# Altium project FIT_TCM.PrjPcb (part 7 of 9)

## Sheet FIT_HDMI_X19-9.SchDoc: FIT_PM12 board
size 420 x 297 mm; CheckedBy: G.Kasprowicz; Author: INR Moscow; CompanyName: WUT ISE; DrawnBy: M.Podgórski; Organization: WUT ISE; Address1: PW ISE; Address2: Nowowiejska 15/19 00-665 Warsaw; Address3: gkasprow@gmail.com; Revision: 2; SheetNumber: -; SheetTotal: -; ModifiedBy: -; CheckedDate: -; Title2: Title 2; DivGrp: WUT ISE; Designer: INR RAS; ModifiedDate: -; ProjectName: Sensor Box
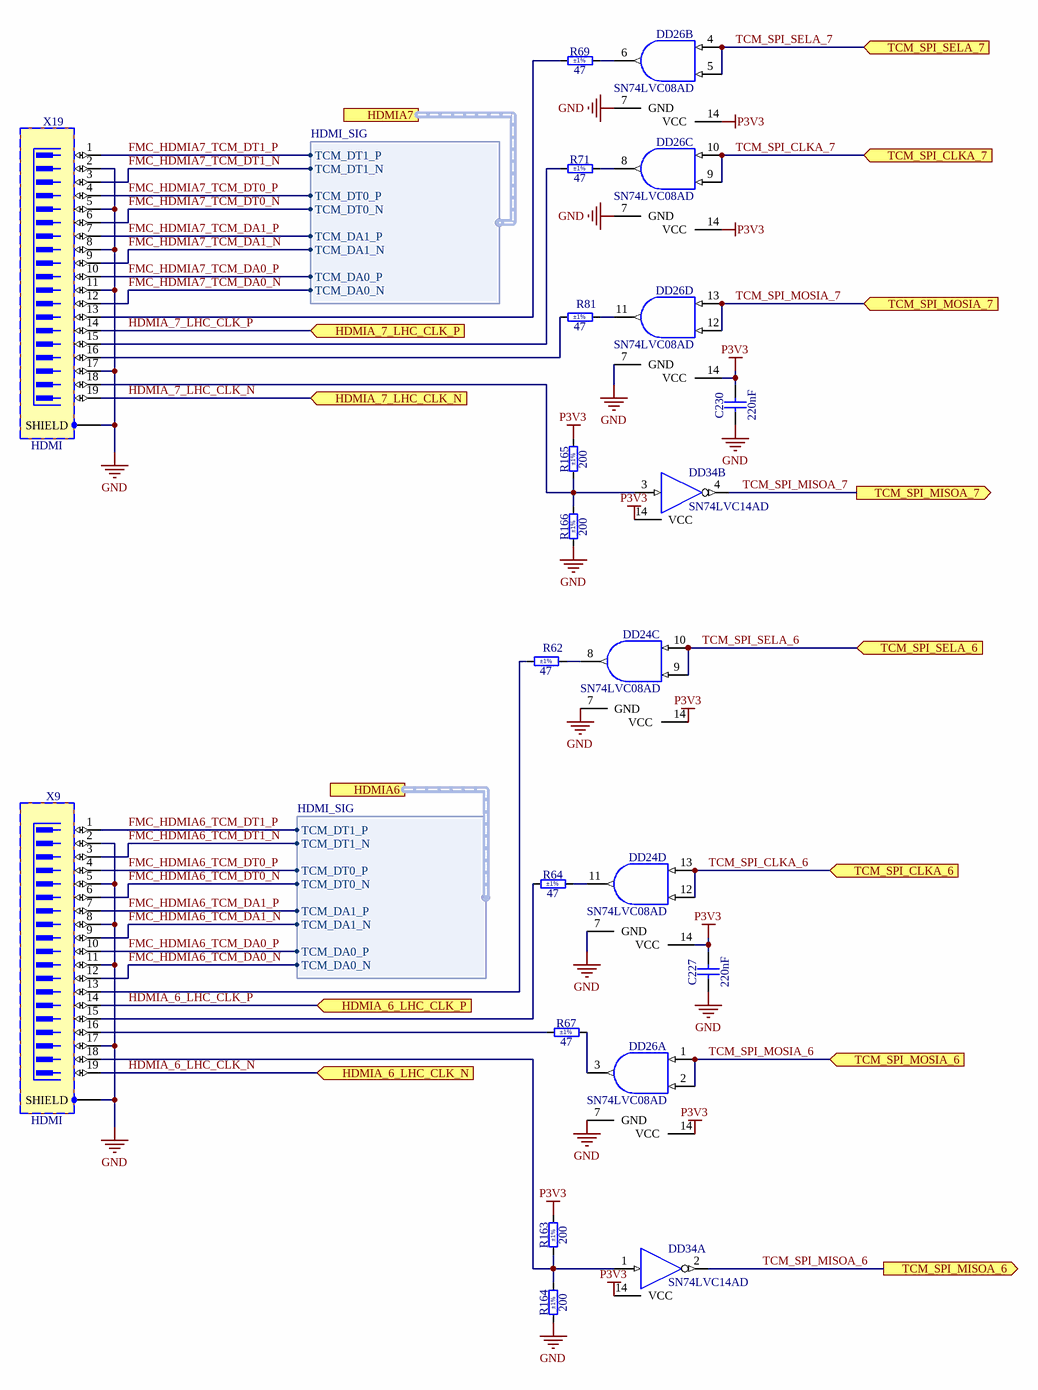
[diagram p22: FIT_HDMI_X19-9.SchDoc]

### Parts
C227  220nF  [CAPC2012X135N]
C230  220nF  [CAPC2012X135N]
DD24  SN74LVC08AD  [SOIC127P600X175-14N]  (parts C,D of 4)
DD26  SN74LVC08AD  [SOIC127P600X175-14N]  (parts A,B,C,D of 4)
DD34  SN74LVC14AD  [SOIC127P600X175-14N]  (parts A,B of 6)
R62  47  Tolerance: ±1%  [RESC2012X60N]
R64  47  Tolerance: ±1%  [RESC2012X60N]
R67  47  Tolerance: ±1%  [RESC2012X60N]
R69  47  Tolerance: ±1%  [RESC2012X60N]
R71  47  Tolerance: ±1%  [RESC2012X60N]
R81  47  Tolerance: ±1%  [RESC2012X60N]
R163  200  Tolerance: ±1%  [RESC2012X60N]
R164  200  Tolerance: ±1%  [RESC2012X60N]
R165  200  Tolerance: ±1%  [RESC2012X60N]
R166  200  Tolerance: ±1%  [RESC2012X60N]
X9  HDMI  [TYCO_2007435-1]
X19  HDMI  [TYCO_2007435-1]

### Ports
HDMIA6 (harness HDMI_SIG), HDMIA7 (harness HDMI_SIG), HDMIA_6_LHC_CLK_N (in), HDMIA_6_LHC_CLK_P (in), HDMIA_7_LHC_CLK_N (in), HDMIA_7_LHC_CLK_P (in), TCM_SPI_CLKA_6 (in), TCM_SPI_CLKA_7 (in), TCM_SPI_MISOA_6 (out), TCM_SPI_MISOA_7 (out), TCM_SPI_MOSIA_6 (in), TCM_SPI_MOSIA_7 (in), TCM_SPI_SELA_6 (in), TCM_SPI_SELA_7 (in)

### Harnesses
HDMI_SIG: TCM_DT1_P, TCM_DT1_N, TCM_DT0_P, TCM_DT0_N, TCM_DA1_P, TCM_DA1_N, TCM_DA0_P, TCM_DA0_N

### Nets
GND: C227.1 C230.1 DD24.7(GND) DD26.7(GND) DD34.7(GND) R164.1 R166.1 X9.2 X9.5 X9.8 X9.11 X9.17 X9.SHIELD X19.2 X19.5 X19.8 X19.11 X19.17 X19.SHIELD
P3V3: C227.2 C230.2 DD24.14(VCC) DD26.14(VCC) DD34.14(VCC) R163.2 R165.2  [also labelled VCC]
FMC_HDMIA6_TCM_DA0_N: X9.12 ; port HDMIA6.TCM_DA0_N  [project net HDMIA6.TCM_DA0_N]
FMC_HDMIA6_TCM_DA0_P: X9.10 ; port HDMIA6.TCM_DA0_P  [project net HDMIA6.TCM_DA0_P]
FMC_HDMIA6_TCM_DA1_N: X9.9 ; port HDMIA6.TCM_DA1_N  [project net HDMIA6.TCM_DA1_N]
FMC_HDMIA6_TCM_DA1_P: X9.7 ; port HDMIA6.TCM_DA1_P  [project net HDMIA6.TCM_DA1_P]
FMC_HDMIA6_TCM_DT0_N: X9.6 ; port HDMIA6.TCM_DT0_N  [project net HDMIA6.TCM_DT0_N]
FMC_HDMIA6_TCM_DT0_P: X9.4 ; port HDMIA6.TCM_DT0_P  [project net HDMIA6.TCM_DT0_P]
FMC_HDMIA6_TCM_DT1_N: X9.3 ; port HDMIA6.TCM_DT1_N  [project net HDMIA6.TCM_DT1_N]
FMC_HDMIA6_TCM_DT1_P: X9.1 ; port HDMIA6.TCM_DT1_P  [project net HDMIA6.TCM_DT1_P]
FMC_HDMIA7_TCM_DA0_N: X19.12 ; port HDMIA7.TCM_DA0_N  [project net HDMIA7.TCM_DA0_N]
FMC_HDMIA7_TCM_DA0_P: X19.10 ; port HDMIA7.TCM_DA0_P  [project net HDMIA7.TCM_DA0_P]
FMC_HDMIA7_TCM_DA1_N: X19.9 ; port HDMIA7.TCM_DA1_N  [project net HDMIA7.TCM_DA1_N]
FMC_HDMIA7_TCM_DA1_P: X19.7 ; port HDMIA7.TCM_DA1_P  [project net HDMIA7.TCM_DA1_P]
FMC_HDMIA7_TCM_DT0_N: X19.6 ; port HDMIA7.TCM_DT0_N  [project net HDMIA7.TCM_DT0_N]
FMC_HDMIA7_TCM_DT0_P: X19.4 ; port HDMIA7.TCM_DT0_P  [project net HDMIA7.TCM_DT0_P]
FMC_HDMIA7_TCM_DT1_N: X19.3 ; port HDMIA7.TCM_DT1_N  [project net HDMIA7.TCM_DT1_N]
FMC_HDMIA7_TCM_DT1_P: X19.1 ; port HDMIA7.TCM_DT1_P  [project net HDMIA7.TCM_DT1_P]
HDMIA_6_LHC_CLK_N: X9.19 ; port HDMIA_6_LHC_CLK_N  [project net HDMIA_LHC.6_LHC_CLK_N]
HDMIA_6_LHC_CLK_P: X9.14 ; port HDMIA_6_LHC_CLK_P  [project net HDMIA_LHC.6_LHC_CLK_P]
HDMIA_7_LHC_CLK_N: X19.19 ; port HDMIA_7_LHC_CLK_N  [project net HDMIA_LHC.7_LHC_CLK_N]
HDMIA_7_LHC_CLK_P: X19.14 ; port HDMIA_7_LHC_CLK_P  [project net HDMIA_LHC.7_LHC_CLK_P]
TCM_SPI_CLKA_6: DD24.12(B) DD24.13(A) ; port TCM_SPI_CLKA_6
TCM_SPI_CLKA_7: DD26.9(B) DD26.10(A) ; port TCM_SPI_CLKA_7
TCM_SPI_MISOA_6: DD34.2(OUT) ; port TCM_SPI_MISOA_6
TCM_SPI_MISOA_7: DD34.4(OUT) ; port TCM_SPI_MISOA_7
TCM_SPI_MOSIA_6: DD26.1(A) DD26.2(B) ; port TCM_SPI_MOSIA_6
TCM_SPI_MOSIA_7: DD26.12(B) DD26.13(A) ; port TCM_SPI_MOSIA_7
TCM_SPI_SELA_6: DD24.9(B) DD24.10(A) ; port TCM_SPI_SELA_6
TCM_SPI_SELA_7: DD26.4(A) DD26.5(B) ; port TCM_SPI_SELA_7
NetDD24_8: DD24.8(Y) R62.2
NetDD24_11: DD24.11(Y) R64.2
NetDD26_3: DD26.3(Y) R67.2
NetDD26_6: DD26.6(Y) R69.2
NetDD26_8: DD26.8(Y) R71.2
NetDD26_11: DD26.11(Y) R81.2
NetDD34_1: DD34.1(IN) R163.1 R164.2 X9.18
NetDD34_3: DD34.3(IN) R165.1 R166.2 X19.18
NetR62_1: R62.1 X9.13
NetR64_1: R64.1 X9.15
NetR67_1: R67.1 X9.16
NetR69_1: R69.1 X19.13
NetR71_1: R71.1 X19.15
NetR81_1: R81.1 X19.16

### Notes on the sheet
- Project/Equipment
- Document
- Designer
- Drawn by
- Check.by
- Copyright WUT ISE 2024.
  This documentation describes Open Hardware and is licensed under the CERN OHL v.2. You may redistribute and modify this documentation under the terms of the CERN OHL v.2. (http://ohwr.org/CERNOHL). This documentation is distributed WITHOUT ANY EXPRESS OR IMPLIED WARRANTY, INCLUDING OF MERCHANTABILITY, SATISFACTORY QUALITY AND FITNESS FOR A PARTICULAR PURPOSE. Please see the CERN OHL v.2 for applicable conditions.
- Contact
- File
- Last Mod.
- Print Date
- Sheet
- Size
- A3
- of
- Rev

### Library data of the parts
C227 C230 = CC0805_220NF_50V_10%_X7R: Non-polarised capacitor; Part Description: SMD Multilayer Chip Ceramic Capacitor; Manufacturer: GENERIC; Manufacturer1 Part Number: GRM21BR71H224KA01L; Voltage: 50V; TC: X7R; Tolerance: ±10%; Part Number: CC0805_220NF_50V_10%_X7R; Component Kind: Standard; Component Type: Standard; Pin Count: 2; Value: 220nF; Status: Preferred; Manufacturer Part Number: CC0805_220NF_50V_10%_X7R; Case: 0805; Mounted: Yes; Socket: No; SMD: Yes; Sense: No; Manufacturer1 Example: MURATA; Manufacturer1 ComponentHeight: 1.35mm; HelpURL: \\cern.ch\dfs\Applications\Altium\Datasheets\CC0805_X7R_MURATA.pdf; Author: CERN DEM JLC; CreateDate: 03.12.2007; LatestRevisionDate: 03.12.2007
DD24 DD26 = SN74LVC08AD: Quad 2-Input AND Gate; Part Description: Quadruple 2-Input Positive-AND Gate; Manufacturer: TEXAS INSTRUMENTS; PressFit: No; Bonding: No; Part Number: SN74LVC08AD; Component Kind: Standard; Component Type: Standard; Device: SN74LVC08AD; PackageDescription: SOIC 14, Pitch 1.27mm - Body 4x8.75mm, IPC Medium Density; Manufacturer Part Number: SN74LVC08AD; Pin Count: 14; Case: SOIC14; Mounted: Yes; Socket: No; SMD: Yes; Sense: No; ComponentHeight: 1.75mm; Author: CERN DEM JLC; HelpURL: \\cern.ch\dfs\Applications\Altium\Datasheets\SN74LVC08AD.pdf; CreateDate: 21.03.2012; LatestRevisionDate: 21.03.2012
DD34 = SN74LVC14AD: Hex Schmitt-Trigger Inverter; Manufacturer: TEXAS INSTRUMENTS; PressFit: No; Bonding: No; Part Number: SN74LVC14AD; Component Kind: Standard; Component Type: Standard; Device: SN74LVC14AD; PackageDescription: SOIC 14, Pitch 1.27mm - Body 4x8.75mm, IPC Medium Density; Part Description: Hex Schmitt-Trigger Inverter; Manufacturer Part Number: SN74LVC14AD; Pin Count: 14; Case: SOIC14; Mounted: Yes; Socket: No; SMD: Yes; Sense: No; ComponentHeight: 1.75mm; Author: CERN DEM JMW; HelpURL: \\cern.ch\dfs\Applications\Altium\Datasheets\SN74LVC14AD.pdf; CreateDate: 29.09.2008; LatestRevisionDate: 29.09.2008
R62 R64 R67 R69 R71 R81 = R0805_47R_1%_0.125W_100PPM: Resistor - 1%; Part Description: General Purpose Thick Film Chip Resistor; Manufacturer: GENERIC; Manufacturer1 Part Number: NRC10F47R0TRF; Power: 0.125W; TC: ±100ppm/°C; PressFit: No; Part Number: R0805_47R_1%_0.125W_100PPM; Component Kind: Standard; Component Type: Standard; Pin Count: 2; Value: 47; Status: Preferred; Manufacturer Part Number: R0805_47R_1%_0.125W_100PPM; Case: 0805; Mounted: Yes; Sense: No; Socket: No; SMD: Yes; Manufacturer1 Example: NIC COMPONENT; Manufacturer1 ComponentHeight: 0.6mm; HelpURL: \\cern.ch\dfs\Applications\Altium\Datasheets\R0805_NIC_NRC.pdf; Author: CERN DEM JLC; CreateDate: 03.12.2007; LatestRevisionDate: 13.03.2008
R163-R166 = R0805_200R_1%_0.125W_100PPM: Resistor - 1%; Part Description: General Purpose Thick Film Chip Resistor; Manufacturer: GENERIC; Manufacturer1 Part Number: NRC10F2000TRF; Power: 0.125W; TC: ±100ppm/°C; PressFit: No; Part Number: R0805_200R_1%_0.125W_100PPM; Component Kind: Standard; Component Type: Standard; Pin Count: 2; Value: 200; Status: Preferred; Manufacturer Part Number: R0805_200R_1%_0.125W_100PPM; Case: 0805; Mounted: Yes; Sense: No; Socket: No; SMD: Yes; Manufacturer1 Example: NIC COMPONENT; Manufacturer1 ComponentHeight: 0.6mm; HelpURL: \\cern.ch\dfs\Applications\Altium\Datasheets\R0805_NIC_NRC.pdf; Author: CERN DEM JLC; CreateDate: 03.12.2007; LatestRevisionDate: 13.03.2008
X9 X19 = TYCO_2007435-1: Connector HDMI 19 Male + 1 Shield; Part Description: 0.578mm Pitch, Through-Hole Right Angle 19 Contacts Flag-HDMI Type-A Receptacle Thru Hole Mounting Pads; Manufacturer: TYCO ELECTRONICS; PressFit: No; Part Number: TYCO_2007435-1; Component Kind: Standard; Component Type: Standard; Pin Count: 23; Family: HDMI; Mounted: Yes; Socket: No; SMD: No; Sense: No; Status: None; Manufacturer Part Number: 2007435-1; ComponentHeight: 16.4mm; HelpURL: \\cern.ch\dfs\Applications\Altium\Datasheets\TYCO_2007435-1.pdf; Author: CERN DEM MR; CreateDate: 05.07.2016; LatestRevisionDate: 05.07.2016

## Sheet FIT_HDMI_X32-26.SchDoc: FIT_PM12 board
size 420 x 297 mm; CheckedBy: G.Kasprowicz; Author: INR Moscow; CompanyName: WUT ISE; DrawnBy: M.Podgórski; Organization: WUT ISE; Address1: PW ISE; Address2: Nowowiejska 15/19 00-665 Warsaw; Address3: gkasprow@gmail.com; Revision: 2; SheetNumber: -; SheetTotal: -; ModifiedBy: -; CheckedDate: -; Title2: Title 2; DivGrp: WUT ISE; Designer: INR RAS; ModifiedDate: -; ProjectName: Sensor Box
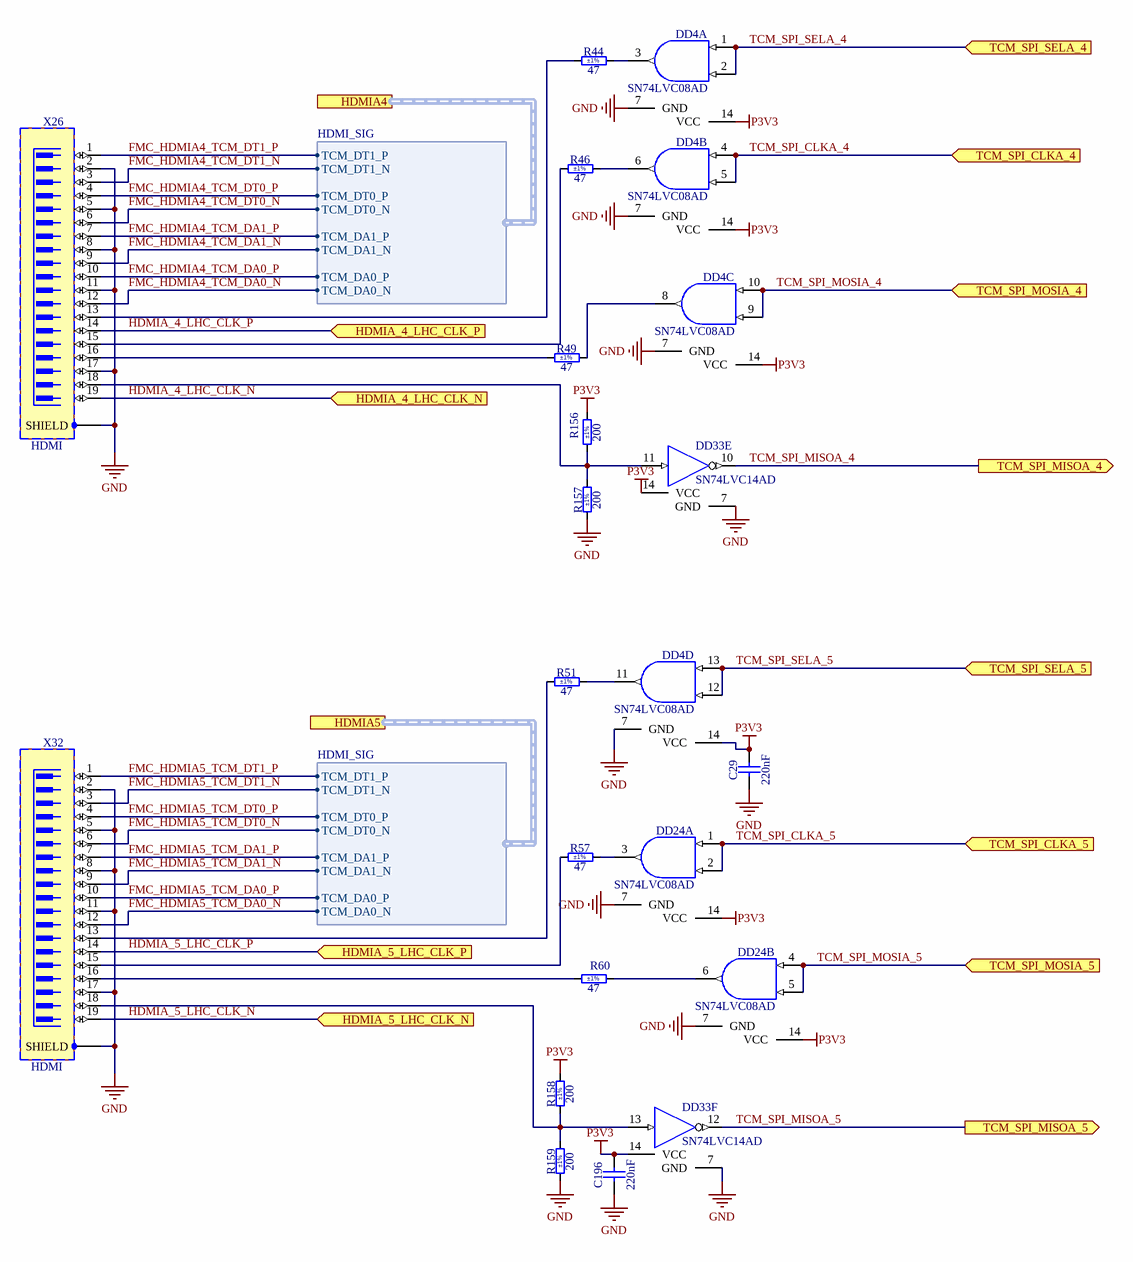
[diagram p23: FIT_HDMI_X32-26.SchDoc]

### Parts
C29  220nF  [CAPC2012X135N]
C196  220nF  [CAPC2012X135N]
DD4  SN74LVC08AD  [SOIC127P600X175-14N]  (parts A,B,C,D of 4)
DD24  SN74LVC08AD  [SOIC127P600X175-14N]  (parts A,B of 4)
DD33  SN74LVC14AD  [SOIC127P600X175-14N]  (parts E,F of 6)
R44  47  Tolerance: ±1%  [RESC2012X60N]
R46  47  Tolerance: ±1%  [RESC2012X60N]
R49  47  Tolerance: ±1%  [RESC2012X60N]
R51  47  Tolerance: ±1%  [RESC2012X60N]
R57  47  Tolerance: ±1%  [RESC2012X60N]
R60  47  Tolerance: ±1%  [RESC2012X60N]
R156  200  Tolerance: ±1%  [RESC2012X60N]
R157  200  Tolerance: ±1%  [RESC2012X60N]
R158  200  Tolerance: ±1%  [RESC2012X60N]
R159  200  Tolerance: ±1%  [RESC2012X60N]
X26  HDMI  [TYCO_2007435-1]
X32  HDMI  [TYCO_2007435-1]

### Ports
HDMIA4 (harness HDMI_SIG), HDMIA5 (harness HDMI_SIG), HDMIA_4_LHC_CLK_N (in), HDMIA_4_LHC_CLK_P (in), HDMIA_5_LHC_CLK_N (in), HDMIA_5_LHC_CLK_P (in), TCM_SPI_CLKA_4 (in), TCM_SPI_CLKA_5 (in), TCM_SPI_MISOA_4 (out), TCM_SPI_MISOA_5 (out), TCM_SPI_MOSIA_4 (in), TCM_SPI_MOSIA_5 (in), TCM_SPI_SELA_4 (in), TCM_SPI_SELA_5 (in)

### Harnesses
HDMI_SIG: TCM_DT1_P, TCM_DT1_N, TCM_DT0_P, TCM_DT0_N, TCM_DA1_P, TCM_DA1_N, TCM_DA0_P, TCM_DA0_N

### Nets
GND: C29.1 C196.1 DD4.7(GND) DD24.7(GND) DD33.7(GND) R157.1 R159.1 X26.2 X26.5 X26.8 X26.11 X26.17 X26.SHIELD X32.2 X32.5 X32.8 X32.11 X32.17 X32.SHIELD
P3V3: C29.2 C196.2 DD4.14(VCC) DD24.14(VCC) DD33.14(VCC) R156.2 R158.2  [also labelled VCC]
FMC_HDMIA4_TCM_DA0_N: X26.12 ; port HDMIA4.TCM_DA0_N  [project net HDMIA4.TCM_DA0_N]
FMC_HDMIA4_TCM_DA0_P: X26.10 ; port HDMIA4.TCM_DA0_P  [project net HDMIA4.TCM_DA0_P]
FMC_HDMIA4_TCM_DA1_N: X26.9 ; port HDMIA4.TCM_DA1_N  [project net HDMIA4.TCM_DA1_N]
FMC_HDMIA4_TCM_DA1_P: X26.7 ; port HDMIA4.TCM_DA1_P  [project net HDMIA4.TCM_DA1_P]
FMC_HDMIA4_TCM_DT0_N: X26.6 ; port HDMIA4.TCM_DT0_N  [project net HDMIA4.TCM_DT0_N]
FMC_HDMIA4_TCM_DT0_P: X26.4 ; port HDMIA4.TCM_DT0_P  [project net HDMIA4.TCM_DT0_P]
FMC_HDMIA4_TCM_DT1_N: X26.3 ; port HDMIA4.TCM_DT1_N  [project net HDMIA4.TCM_DT1_N]
FMC_HDMIA4_TCM_DT1_P: X26.1 ; port HDMIA4.TCM_DT1_P  [project net HDMIA4.TCM_DT1_P]
FMC_HDMIA5_TCM_DA0_N: X32.12 ; port HDMIA5.TCM_DA0_N  [project net HDMIA5.TCM_DA0_N]
FMC_HDMIA5_TCM_DA0_P: X32.10 ; port HDMIA5.TCM_DA0_P  [project net HDMIA5.TCM_DA0_P]
FMC_HDMIA5_TCM_DA1_N: X32.9 ; port HDMIA5.TCM_DA1_N  [project net HDMIA5.TCM_DA1_N]
FMC_HDMIA5_TCM_DA1_P: X32.7 ; port HDMIA5.TCM_DA1_P  [project net HDMIA5.TCM_DA1_P]
FMC_HDMIA5_TCM_DT0_N: X32.6 ; port HDMIA5.TCM_DT0_N  [project net HDMIA5.TCM_DT0_N]
FMC_HDMIA5_TCM_DT0_P: X32.4 ; port HDMIA5.TCM_DT0_P  [project net HDMIA5.TCM_DT0_P]
FMC_HDMIA5_TCM_DT1_N: X32.3 ; port HDMIA5.TCM_DT1_N  [project net HDMIA5.TCM_DT1_N]
FMC_HDMIA5_TCM_DT1_P: X32.1 ; port HDMIA5.TCM_DT1_P  [project net HDMIA5.TCM_DT1_P]
HDMIA_4_LHC_CLK_N: X26.19 ; port HDMIA_4_LHC_CLK_N  [project net HDMIA_LHC.4_LHC_CLK_N]
HDMIA_4_LHC_CLK_P: X26.14 ; port HDMIA_4_LHC_CLK_P  [project net HDMIA_LHC.4_LHC_CLK_P]
HDMIA_5_LHC_CLK_N: X32.19 ; port HDMIA_5_LHC_CLK_N  [project net HDMIA_LHC.5_LHC_CLK_N]
HDMIA_5_LHC_CLK_P: X32.14 ; port HDMIA_5_LHC_CLK_P  [project net HDMIA_LHC.5_LHC_CLK_P]
TCM_SPI_CLKA_4: DD4.4(A) DD4.5(B) ; port TCM_SPI_CLKA_4
TCM_SPI_CLKA_5: DD24.1(A) DD24.2(B) ; port TCM_SPI_CLKA_5
TCM_SPI_MISOA_4: DD33.10(OUT) ; port TCM_SPI_MISOA_4
TCM_SPI_MISOA_5: DD33.12(OUT) ; port TCM_SPI_MISOA_5
TCM_SPI_MOSIA_4: DD4.9(B) DD4.10(A) ; port TCM_SPI_MOSIA_4
TCM_SPI_MOSIA_5: DD24.4(A) DD24.5(B) ; port TCM_SPI_MOSIA_5
TCM_SPI_SELA_4: DD4.1(A) DD4.2(B) ; port TCM_SPI_SELA_4
TCM_SPI_SELA_5: DD4.12(B) DD4.13(A) ; port TCM_SPI_SELA_5
NetDD4_3: DD4.3(Y) R44.2
NetDD4_6: DD4.6(Y) R46.2
NetDD4_8: DD4.8(Y) R49.2
NetDD4_11: DD4.11(Y) R51.2
NetDD24_3: DD24.3(Y) R57.2
NetDD24_6: DD24.6(Y) R60.2
NetDD33_11: DD33.11(IN) R156.1 R157.2 X26.18
NetDD33_13: DD33.13(IN) R158.1 R159.2 X32.18
NetR44_1: R44.1 X26.13
NetR46_1: R46.1 X26.15
NetR49_1: R49.1 X26.16
NetR51_1: R51.1 X32.13
NetR57_1: R57.1 X32.15
NetR60_1: R60.1 X32.16

### Notes on the sheet
- Project/Equipment
- Document
- Designer
- Drawn by
- Check.by
- Copyright WUT ISE 2024.
  This documentation describes Open Hardware and is licensed under the CERN OHL v.2. You may redistribute and modify this documentation under the terms of the CERN OHL v.2. (http://ohwr.org/CERNOHL). This documentation is distributed WITHOUT ANY EXPRESS OR IMPLIED WARRANTY, INCLUDING OF MERCHANTABILITY, SATISFACTORY QUALITY AND FITNESS FOR A PARTICULAR PURPOSE. Please see the CERN OHL v.2 for applicable conditions.
- Contact
- File
- Last Mod.
- Print Date
- Sheet
- Size
- A3
- of
- Rev

### Library data of the parts
C29 C196 = CC0805_220NF_50V_10%_X7R: as C227 on sheet FIT_HDMI_X19-9; Part Number: CC0805_220NF_50V_10%_X7R; Component Kind: Standard; Component Type: Standard; Pin Count: 2; Value: 220nF; Status: Preferred; Manufacturer Part Number: CC0805_220NF_50V_10%_X7R; Case: 0805; Mounted: Yes; Socket: No; SMD: Yes; Sense: No; Manufacturer1 Example: MURATA; Manufacturer1 ComponentHeight: 1.35mm; HelpURL: \\cern.ch\dfs\Applications\Altium\Datasheets\CC0805_X7R_MURATA.pdf; Author: CERN DEM JLC; CreateDate: 03.12.2007; LatestRevisionDate: 03.12.2007
DD4 DD24 = SN74LVC08AD: as DD24 on sheet FIT_HDMI_X19-9; Part Number: SN74LVC08AD; Component Kind: Standard; Component Type: Standard; Device: SN74LVC08AD; PackageDescription: SOIC 14, Pitch 1.27mm - Body 4x8.75mm, IPC Medium Density; Manufacturer Part Number: SN74LVC08AD; Pin Count: 14; Case: SOIC14; Mounted: Yes; Socket: No; SMD: Yes; Sense: No; ComponentHeight: 1.75mm; Author: CERN DEM JLC; HelpURL: \\cern.ch\dfs\Applications\Altium\Datasheets\SN74LVC08AD.pdf; CreateDate: 21.03.2012; LatestRevisionDate: 21.03.2012
DD33 = SN74LVC14AD: as DD34 on sheet FIT_HDMI_X19-9; Part Number: SN74LVC14AD; Component Kind: Standard; Component Type: Standard; Device: SN74LVC14AD; PackageDescription: SOIC 14, Pitch 1.27mm - Body 4x8.75mm, IPC Medium Density; Part Description: Hex Schmitt-Trigger Inverter; Manufacturer Part Number: SN74LVC14AD; Pin Count: 14; Case: SOIC14; Mounted: Yes; Socket: No; SMD: Yes; Sense: No; ComponentHeight: 1.75mm; Author: CERN DEM JMW; HelpURL: \\cern.ch\dfs\Applications\Altium\Datasheets\SN74LVC14AD.pdf; CreateDate: 29.09.2008; LatestRevisionDate: 29.09.2008
R44 R46 R49 R51 R57 R60 = R0805_47R_1%_0.125W_100PPM: as R62 on sheet FIT_HDMI_X19-9; Part Number: R0805_47R_1%_0.125W_100PPM; Component Kind: Standard; Component Type: Standard; Pin Count: 2; Value: 47; Status: Preferred; Manufacturer Part Number: R0805_47R_1%_0.125W_100PPM; Case: 0805; Mounted: Yes; Sense: No; Socket: No; SMD: Yes; Manufacturer1 Example: NIC COMPONENT; Manufacturer1 ComponentHeight: 0.6mm; HelpURL: \\cern.ch\dfs\Applications\Altium\Datasheets\R0805_NIC_NRC.pdf; Author: CERN DEM JLC; CreateDate: 03.12.2007; LatestRevisionDate: 13.03.2008
R156-R159 = R0805_200R_1%_0.125W_100PPM: as R163-R166 on sheet FIT_HDMI_X19-9; Part Number: R0805_200R_1%_0.125W_100PPM; Component Kind: Standard; Component Type: Standard; Pin Count: 2; Value: 200; Status: Preferred; Manufacturer Part Number: R0805_200R_1%_0.125W_100PPM; Case: 0805; Mounted: Yes; Sense: No; Socket: No; SMD: Yes; Manufacturer1 Example: NIC COMPONENT; Manufacturer1 ComponentHeight: 0.6mm; HelpURL: \\cern.ch\dfs\Applications\Altium\Datasheets\R0805_NIC_NRC.pdf; Author: CERN DEM JLC; CreateDate: 03.12.2007; LatestRevisionDate: 13.03.2008
X26 X32 = TYCO_2007435-1: as X9 on sheet FIT_HDMI_X19-9; Part Number: TYCO_2007435-1; Component Kind: Standard; Component Type: Standard; Pin Count: 23; Family: HDMI; Mounted: Yes; Socket: No; SMD: No; Sense: No; Status: None; Manufacturer Part Number: 2007435-1; ComponentHeight: 16.4mm; HelpURL: \\cern.ch\dfs\Applications\Altium\Datasheets\TYCO_2007435-1.pdf; Author: CERN DEM MR; CreateDate: 05.07.2016; LatestRevisionDate: 05.07.2016

## Sheet FIT_HDMI_X22-18.SchDoc: FIT_PM12 board
size 420 x 297 mm; CheckedBy: G.Kasprowicz; Author: INR Moscow; CompanyName: WUT ISE; DrawnBy: M.Podgórski; Organization: WUT ISE; Address1: PW ISE; Address2: Nowowiejska 15/19 00-665 Warsaw; Address3: gkasprow@gmail.com; Revision: 2; SheetNumber: -; SheetTotal: -; ModifiedBy: -; CheckedDate: -; Title2: Title 2; DivGrp: WUT ISE; Designer: INR RAS; ModifiedDate: -; ProjectName: Sensor Box
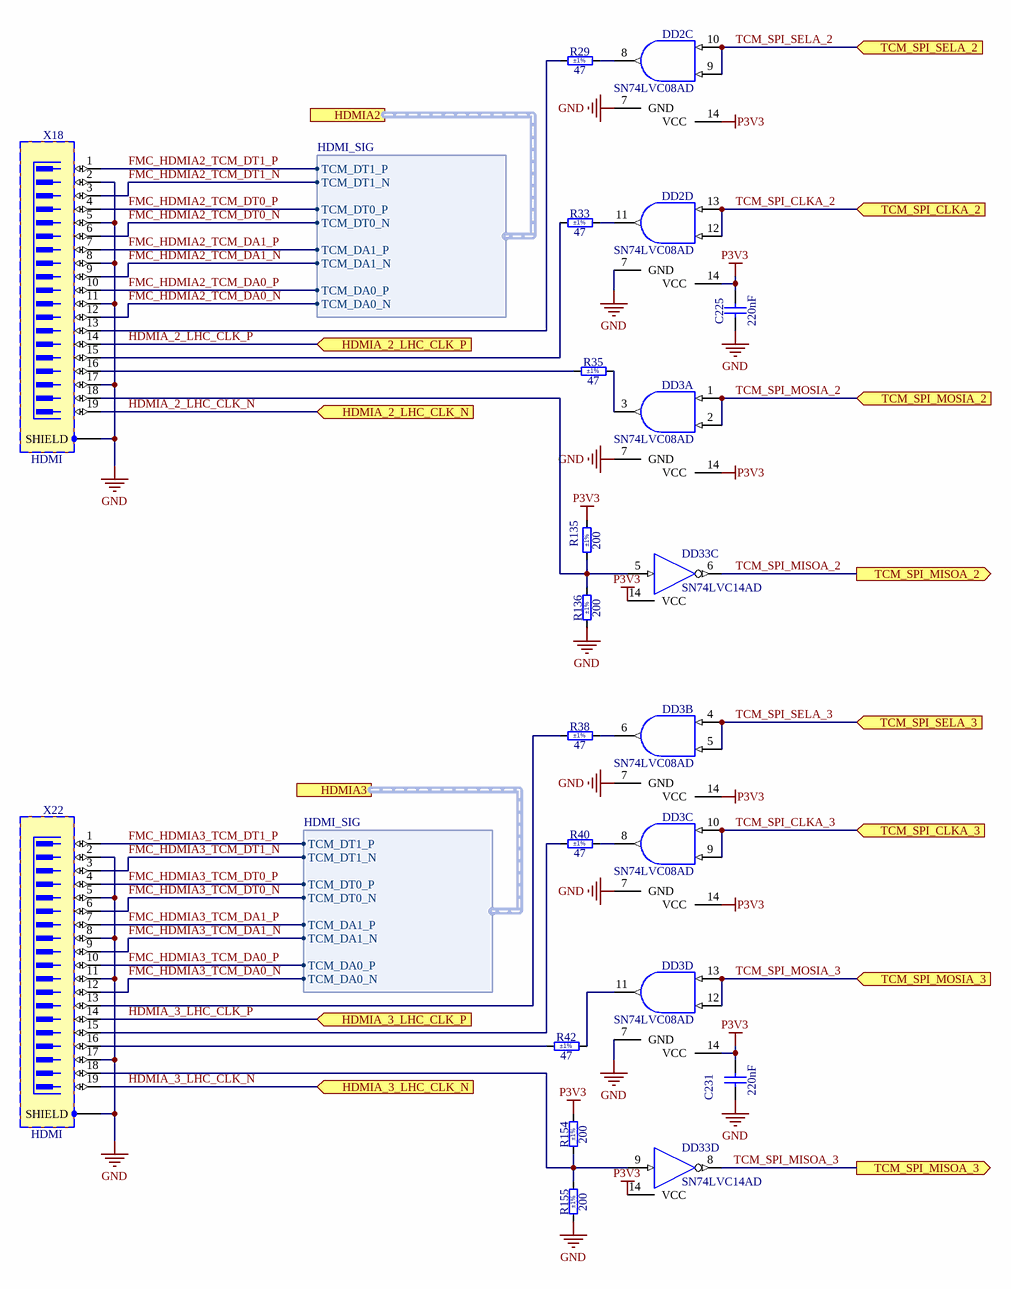
[diagram p24: FIT_HDMI_X22-18.SchDoc]

### Parts
C225  220nF  [CAPC2012X135N]
C231  220nF  [CAPC2012X135N]
DD2  SN74LVC08AD  [SOIC127P600X175-14N]  (parts C,D of 4)
DD3  SN74LVC08AD  [SOIC127P600X175-14N]  (parts A,B,C,D of 4)
DD33  SN74LVC14AD  [SOIC127P600X175-14N]  (parts C,D of 6)
R29  47  Tolerance: ±1%  [RESC2012X60N]
R33  47  Tolerance: ±1%  [RESC2012X60N]
R35  47  Tolerance: ±1%  [RESC2012X60N]
R38  47  Tolerance: ±1%  [RESC2012X60N]
R40  47  Tolerance: ±1%  [RESC2012X60N]
R42  47  Tolerance: ±1%  [RESC2012X60N]
R135  200  Tolerance: ±1%  [RESC2012X60N]
R136  200  Tolerance: ±1%  [RESC2012X60N]
R154  200  Tolerance: ±1%  [RESC2012X60N]
R155  200  Tolerance: ±1%  [RESC2012X60N]
X18  HDMI  [TYCO_2007435-1]
X22  HDMI  [TYCO_2007435-1]

### Ports
HDMIA2 (harness HDMI_SIG), HDMIA3 (harness HDMI_SIG), HDMIA_2_LHC_CLK_N (in), HDMIA_2_LHC_CLK_P (in), HDMIA_3_LHC_CLK_N (in), HDMIA_3_LHC_CLK_P (in), TCM_SPI_CLKA_2 (in), TCM_SPI_CLKA_3 (in), TCM_SPI_MISOA_2 (out), TCM_SPI_MISOA_3 (out), TCM_SPI_MOSIA_2 (in), TCM_SPI_MOSIA_3 (in), TCM_SPI_SELA_2 (in), TCM_SPI_SELA_3 (in)

### Harnesses
HDMI_SIG: TCM_DT1_P, TCM_DT1_N, TCM_DT0_P, TCM_DT0_N, TCM_DA1_P, TCM_DA1_N, TCM_DA0_P, TCM_DA0_N

### Nets
GND: C225.1 C231.1 DD2.7(GND) DD3.7(GND) DD33.7(GND) R136.1 R155.1 X18.2 X18.5 X18.8 X18.11 X18.17 X18.SHIELD X22.2 X22.5 X22.8 X22.11 X22.17 X22.SHIELD
P3V3: C225.2 C231.2 DD2.14(VCC) DD3.14(VCC) DD33.14(VCC) R135.2 R154.2  [also labelled VCC]
FMC_HDMIA2_TCM_DA0_N: X18.12 ; port HDMIA2.TCM_DA0_N  [project net HDMIA2.TCM_DA0_N]
FMC_HDMIA2_TCM_DA0_P: X18.10 ; port HDMIA2.TCM_DA0_P  [project net HDMIA2.TCM_DA0_P]
FMC_HDMIA2_TCM_DA1_N: X18.9 ; port HDMIA2.TCM_DA1_N  [project net HDMIA2.TCM_DA1_N]
FMC_HDMIA2_TCM_DA1_P: X18.7 ; port HDMIA2.TCM_DA1_P  [project net HDMIA2.TCM_DA1_P]
FMC_HDMIA2_TCM_DT0_N: X18.6 ; port HDMIA2.TCM_DT0_N  [project net HDMIA2.TCM_DT0_N]
FMC_HDMIA2_TCM_DT0_P: X18.4 ; port HDMIA2.TCM_DT0_P  [project net HDMIA2.TCM_DT0_P]
FMC_HDMIA2_TCM_DT1_N: X18.3 ; port HDMIA2.TCM_DT1_N  [project net HDMIA2.TCM_DT1_N]
FMC_HDMIA2_TCM_DT1_P: X18.1 ; port HDMIA2.TCM_DT1_P  [project net HDMIA2.TCM_DT1_P]
FMC_HDMIA3_TCM_DA0_N: X22.12 ; port HDMIA3.TCM_DA0_N  [project net HDMIA3.TCM_DA0_N]
FMC_HDMIA3_TCM_DA0_P: X22.10 ; port HDMIA3.TCM_DA0_P  [project net HDMIA3.TCM_DA0_P]
FMC_HDMIA3_TCM_DA1_N: X22.9 ; port HDMIA3.TCM_DA1_N  [project net HDMIA3.TCM_DA1_N]
FMC_HDMIA3_TCM_DA1_P: X22.7 ; port HDMIA3.TCM_DA1_P  [project net HDMIA3.TCM_DA1_P]
FMC_HDMIA3_TCM_DT0_N: X22.6 ; port HDMIA3.TCM_DT0_N  [project net HDMIA3.TCM_DT0_N]
FMC_HDMIA3_TCM_DT0_P: X22.4 ; port HDMIA3.TCM_DT0_P  [project net HDMIA3.TCM_DT0_P]
FMC_HDMIA3_TCM_DT1_N: X22.3 ; port HDMIA3.TCM_DT1_N  [project net HDMIA3.TCM_DT1_N]
FMC_HDMIA3_TCM_DT1_P: X22.1 ; port HDMIA3.TCM_DT1_P  [project net HDMIA3.TCM_DT1_P]
HDMIA_2_LHC_CLK_N: X18.19 ; port HDMIA_2_LHC_CLK_N  [project net HDMIA_LHC.2_LHC_CLK_N]
HDMIA_2_LHC_CLK_P: X18.14 ; port HDMIA_2_LHC_CLK_P  [project net HDMIA_LHC.2_LHC_CLK_P]
HDMIA_3_LHC_CLK_N: X22.19 ; port HDMIA_3_LHC_CLK_N  [project net HDMIA_LHC.3_LHC_CLK_N]
HDMIA_3_LHC_CLK_P: X22.14 ; port HDMIA_3_LHC_CLK_P  [project net HDMIA_LHC.3_LHC_CLK_P]
TCM_SPI_CLKA_2: DD2.12(B) DD2.13(A) ; port TCM_SPI_CLKA_2
TCM_SPI_CLKA_3: DD3.9(B) DD3.10(A) ; port TCM_SPI_CLKA_3
TCM_SPI_MISOA_2: DD33.6(OUT) ; port TCM_SPI_MISOA_2
TCM_SPI_MISOA_3: DD33.8(OUT) ; port TCM_SPI_MISOA_3
TCM_SPI_MOSIA_2: DD3.1(A) DD3.2(B) ; port TCM_SPI_MOSIA_2
TCM_SPI_MOSIA_3: DD3.12(B) DD3.13(A) ; port TCM_SPI_MOSIA_3
TCM_SPI_SELA_2: DD2.9(B) DD2.10(A) ; port TCM_SPI_SELA_2
TCM_SPI_SELA_3: DD3.4(A) DD3.5(B) ; port TCM_SPI_SELA_3
NetDD2_8: DD2.8(Y) R29.2
NetDD2_11: DD2.11(Y) R33.2
NetDD3_3: DD3.3(Y) R35.2
NetDD3_6: DD3.6(Y) R38.2
NetDD3_8: DD3.8(Y) R40.2
NetDD3_11: DD3.11(Y) R42.2
NetDD33_5: DD33.5(IN) R135.1 R136.2 X18.18
NetDD33_9: DD33.9(IN) R154.1 R155.2 X22.18
NetR29_1: R29.1 X18.13
NetR33_1: R33.1 X18.15
NetR35_1: R35.1 X18.16
NetR38_1: R38.1 X22.13
NetR40_1: R40.1 X22.15
NetR42_1: R42.1 X22.16

### Notes on the sheet
- Project/Equipment
- Document
- Designer
- Drawn by
- Check.by
- Copyright WUT ISE 2024.
  This documentation describes Open Hardware and is licensed under the CERN OHL v.2. You may redistribute and modify this documentation under the terms of the CERN OHL v.2. (http://ohwr.org/CERNOHL). This documentation is distributed WITHOUT ANY EXPRESS OR IMPLIED WARRANTY, INCLUDING OF MERCHANTABILITY, SATISFACTORY QUALITY AND FITNESS FOR A PARTICULAR PURPOSE. Please see the CERN OHL v.2 for applicable conditions.
- Contact
- File
- Last Mod.
- Print Date
- Sheet
- Size
- A3
- of
- Rev

### Library data of the parts
C225 C231 = CC0805_220NF_50V_10%_X7R: as C227 on sheet FIT_HDMI_X19-9; Part Number: CC0805_220NF_50V_10%_X7R; Component Kind: Standard; Component Type: Standard; Pin Count: 2; Value: 220nF; Status: Preferred; Manufacturer Part Number: CC0805_220NF_50V_10%_X7R; Case: 0805; Mounted: Yes; Socket: No; SMD: Yes; Sense: No; Manufacturer1 Example: MURATA; Manufacturer1 ComponentHeight: 1.35mm; HelpURL: \\cern.ch\dfs\Applications\Altium\Datasheets\CC0805_X7R_MURATA.pdf; Author: CERN DEM JLC; CreateDate: 03.12.2007; LatestRevisionDate: 03.12.2007
DD2 DD3 = SN74LVC08AD: as DD24 on sheet FIT_HDMI_X19-9; Part Number: SN74LVC08AD; Component Kind: Standard; Component Type: Standard; Device: SN74LVC08AD; PackageDescription: SOIC 14, Pitch 1.27mm - Body 4x8.75mm, IPC Medium Density; Manufacturer Part Number: SN74LVC08AD; Pin Count: 14; Case: SOIC14; Mounted: Yes; Socket: No; SMD: Yes; Sense: No; ComponentHeight: 1.75mm; Author: CERN DEM JLC; HelpURL: \\cern.ch\dfs\Applications\Altium\Datasheets\SN74LVC08AD.pdf; CreateDate: 21.03.2012; LatestRevisionDate: 21.03.2012
DD33 = SN74LVC14AD: as DD34 on sheet FIT_HDMI_X19-9; Part Number: SN74LVC14AD; Component Kind: Standard; Component Type: Standard; Device: SN74LVC14AD; PackageDescription: SOIC 14, Pitch 1.27mm - Body 4x8.75mm, IPC Medium Density; Part Description: Hex Schmitt-Trigger Inverter; Manufacturer Part Number: SN74LVC14AD; Pin Count: 14; Case: SOIC14; Mounted: Yes; Socket: No; SMD: Yes; Sense: No; ComponentHeight: 1.75mm; Author: CERN DEM JMW; HelpURL: \\cern.ch\dfs\Applications\Altium\Datasheets\SN74LVC14AD.pdf; CreateDate: 29.09.2008; LatestRevisionDate: 29.09.2008
R29 R33 R35 R38 R40 R42 = R0805_47R_1%_0.125W_100PPM: as R62 on sheet FIT_HDMI_X19-9; Part Number: R0805_47R_1%_0.125W_100PPM; Component Kind: Standard; Component Type: Standard; Pin Count: 2; Value: 47; Status: Preferred; Manufacturer Part Number: R0805_47R_1%_0.125W_100PPM; Case: 0805; Mounted: Yes; Sense: No; Socket: No; SMD: Yes; Manufacturer1 Example: NIC COMPONENT; Manufacturer1 ComponentHeight: 0.6mm; HelpURL: \\cern.ch\dfs\Applications\Altium\Datasheets\R0805_NIC_NRC.pdf; Author: CERN DEM JLC; CreateDate: 03.12.2007; LatestRevisionDate: 13.03.2008
R135 R136 R154 R155 = R0805_200R_1%_0.125W_100PPM: as R163-R166 on sheet FIT_HDMI_X19-9; Part Number: R0805_200R_1%_0.125W_100PPM; Component Kind: Standard; Component Type: Standard; Pin Count: 2; Value: 200; Status: Preferred; Manufacturer Part Number: R0805_200R_1%_0.125W_100PPM; Case: 0805; Mounted: Yes; Sense: No; Socket: No; SMD: Yes; Manufacturer1 Example: NIC COMPONENT; Manufacturer1 ComponentHeight: 0.6mm; HelpURL: \\cern.ch\dfs\Applications\Altium\Datasheets\R0805_NIC_NRC.pdf; Author: CERN DEM JLC; CreateDate: 03.12.2007; LatestRevisionDate: 13.03.2008
X18 X22 = TYCO_2007435-1: as X9 on sheet FIT_HDMI_X19-9; Part Number: TYCO_2007435-1; Component Kind: Standard; Component Type: Standard; Pin Count: 23; Family: HDMI; Mounted: Yes; Socket: No; SMD: No; Sense: No; Status: None; Manufacturer Part Number: 2007435-1; ComponentHeight: 16.4mm; HelpURL: \\cern.ch\dfs\Applications\Altium\Datasheets\TYCO_2007435-1.pdf; Author: CERN DEM MR; CreateDate: 05.07.2016; LatestRevisionDate: 05.07.2016

## Sheet FIT_HDMI_X31-7.SchDoc: FIT_PM12 board
size 420 x 297 mm; CheckedBy: G.Kasprowicz; Author: INR Moscow; CompanyName: WUT ISE; DrawnBy: M.Podgórski; Organization: WUT ISE; Address1: PW ISE; Address2: Nowowiejska 15/19 00-665 Warsaw; Address3: gkasprow@gmail.com; Revision: 2; SheetNumber: -; SheetTotal: -; ModifiedBy: -; CheckedDate: -; Title2: Title 2; DivGrp: WUT ISE; Designer: INR RAS; ModifiedDate: -; ProjectName: Sensor Box
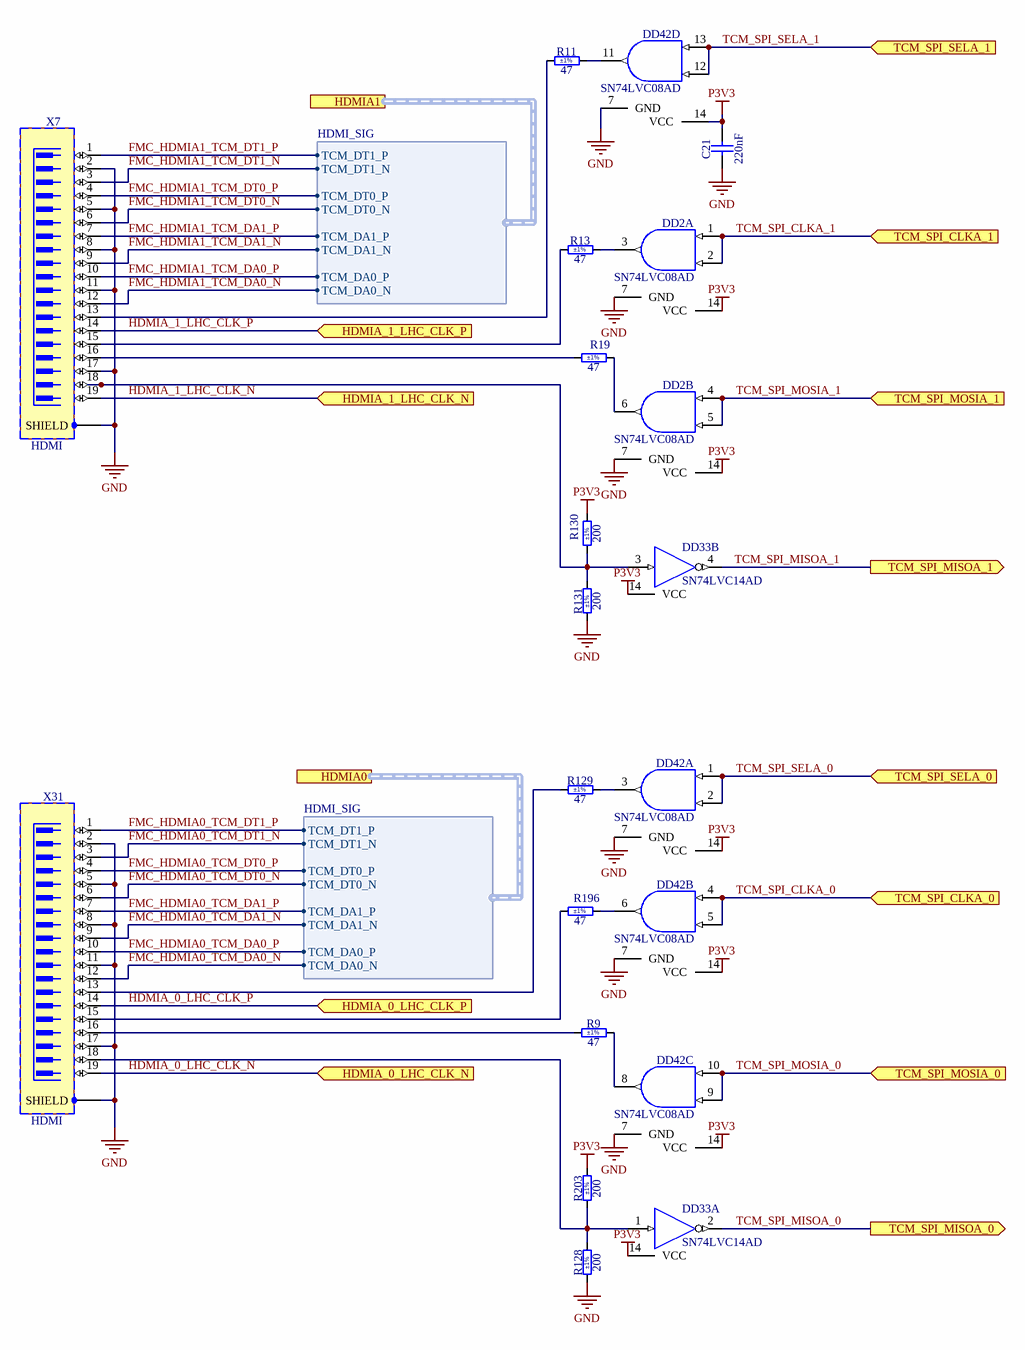
[diagram p25: FIT_HDMI_X31-7.SchDoc]

### Parts
C21  220nF  [CAPC2012X135N]
DD2  SN74LVC08AD  [SOIC127P600X175-14N]  (parts A,B of 4)
DD33  SN74LVC14AD  [SOIC127P600X175-14N]  (parts A,B of 6)
DD42  SN74LVC08AD  [SOIC127P600X175-14N]  (parts A,B,C,D of 4)
R9  47  Tolerance: ±1%  [RESC2012X60N]
R11  47  Tolerance: ±1%  [RESC2012X60N]
R13  47  Tolerance: ±1%  [RESC2012X60N]
R19  47  Tolerance: ±1%  [RESC2012X60N]
R128  200  Tolerance: ±1%  [RESC2012X60N]
R129  47  Tolerance: ±1%  [RESC2012X60N]
R130  200  Tolerance: ±1%  [RESC2012X60N]
R131  200  Tolerance: ±1%  [RESC2012X60N]
R196  47  Tolerance: ±1%  [RESC2012X60N]
R203  200  Tolerance: ±1%  [RESC2012X60N]
X7  HDMI  [TYCO_2007435-1]
X31  HDMI  [TYCO_2007435-1]

### Ports
HDMIA0 (harness HDMI_SIG), HDMIA1 (harness HDMI_SIG), HDMIA_0_LHC_CLK_N (in), HDMIA_0_LHC_CLK_P (in), HDMIA_1_LHC_CLK_N (in), HDMIA_1_LHC_CLK_P (in), TCM_SPI_CLKA_0 (in), TCM_SPI_CLKA_1 (in), TCM_SPI_MISOA_0 (out), TCM_SPI_MISOA_1 (out), TCM_SPI_MOSIA_0 (in), TCM_SPI_MOSIA_1 (in), TCM_SPI_SELA_0 (in), TCM_SPI_SELA_1 (in)

### Harnesses
HDMI_SIG: TCM_DT1_P, TCM_DT1_N, TCM_DT0_P, TCM_DT0_N, TCM_DA1_P, TCM_DA1_N, TCM_DA0_P, TCM_DA0_N

### Nets
GND: C21.1 DD2.7(GND) DD33.7(GND) DD42.7(GND) R128.1 R131.1 X7.2 X7.5 X7.8 X7.11 X7.17 X7.SHIELD X31.2 X31.5 X31.8 X31.11 X31.17 X31.SHIELD
P3V3: C21.2 DD2.14(VCC) DD33.14(VCC) DD42.14(VCC) R130.2 R203.2  [also labelled VCC]
FMC_HDMIA0_TCM_DA0_N: X31.12 ; port HDMIA0.TCM_DA0_N  [project net HDMIA0.TCM_DA0_N]
FMC_HDMIA0_TCM_DA0_P: X31.10 ; port HDMIA0.TCM_DA0_P  [project net HDMIA0.TCM_DA0_P]
FMC_HDMIA0_TCM_DA1_N: X31.9 ; port HDMIA0.TCM_DA1_N  [project net HDMIA0.TCM_DA1_N]
FMC_HDMIA0_TCM_DA1_P: X31.7 ; port HDMIA0.TCM_DA1_P  [project net HDMIA0.TCM_DA1_P]
FMC_HDMIA0_TCM_DT0_N: X31.6 ; port HDMIA0.TCM_DT0_N  [project net HDMIA0.TCM_DT0_N]
FMC_HDMIA0_TCM_DT0_P: X31.4 ; port HDMIA0.TCM_DT0_P  [project net HDMIA0.TCM_DT0_P]
FMC_HDMIA0_TCM_DT1_N: X31.3 ; port HDMIA0.TCM_DT1_N  [project net HDMIA0.TCM_DT1_N]
FMC_HDMIA0_TCM_DT1_P: X31.1 ; port HDMIA0.TCM_DT1_P  [project net HDMIA0.TCM_DT1_P]
FMC_HDMIA1_TCM_DA0_N: X7.12 ; port HDMIA1.TCM_DA0_N  [project net HDMIA1.TCM_DA0_N]
FMC_HDMIA1_TCM_DA0_P: X7.10 ; port HDMIA1.TCM_DA0_P  [project net HDMIA1.TCM_DA0_P]
FMC_HDMIA1_TCM_DA1_N: X7.9 ; port HDMIA1.TCM_DA1_N  [project net HDMIA1.TCM_DA1_N]
FMC_HDMIA1_TCM_DA1_P: X7.7 ; port HDMIA1.TCM_DA1_P  [project net HDMIA1.TCM_DA1_P]
FMC_HDMIA1_TCM_DT0_N: X7.6 ; port HDMIA1.TCM_DT0_N  [project net HDMIA1.TCM_DT0_N]
FMC_HDMIA1_TCM_DT0_P: X7.4 ; port HDMIA1.TCM_DT0_P  [project net HDMIA1.TCM_DT0_P]
FMC_HDMIA1_TCM_DT1_N: X7.3 ; port HDMIA1.TCM_DT1_N  [project net HDMIA1.TCM_DT1_N]
FMC_HDMIA1_TCM_DT1_P: X7.1 ; port HDMIA1.TCM_DT1_P  [project net HDMIA1.TCM_DT1_P]
HDMIA_0_LHC_CLK_N: X31.19 ; port HDMIA_0_LHC_CLK_N  [project net HDMIA_LHC.0_LHC_CLK_N]
HDMIA_0_LHC_CLK_P: X31.14 ; port HDMIA_0_LHC_CLK_P  [project net HDMIA_LHC.0_LHC_CLK_P]
HDMIA_1_LHC_CLK_N: X7.19 ; port HDMIA_1_LHC_CLK_N  [project net HDMIA_LHC.1_LHC_CLK_N]
HDMIA_1_LHC_CLK_P: X7.14 ; port HDMIA_1_LHC_CLK_P  [project net HDMIA_LHC.1_LHC_CLK_P]
TCM_SPI_CLKA_0: DD42.4(A) DD42.5(B) ; port TCM_SPI_CLKA_0
TCM_SPI_CLKA_1: DD2.1(A) DD2.2(B) ; port TCM_SPI_CLKA_1
TCM_SPI_MISOA_0: DD33.2(OUT) ; port TCM_SPI_MISOA_0
TCM_SPI_MISOA_1: DD33.4(OUT) ; port TCM_SPI_MISOA_1
TCM_SPI_MOSIA_0: DD42.9(B) DD42.10(A) ; port TCM_SPI_MOSIA_0
TCM_SPI_MOSIA_1: DD2.4(A) DD2.5(B) ; port TCM_SPI_MOSIA_1
TCM_SPI_SELA_0: DD42.1(A) DD42.2(B) ; port TCM_SPI_SELA_0
TCM_SPI_SELA_1: DD42.12(B) DD42.13(A) ; port TCM_SPI_SELA_1
NetDD2_3: DD2.3(Y) R13.2
NetDD2_6: DD2.6(Y) R19.2
NetDD33_1: DD33.1(IN) R128.2 R203.1 X31.18
NetDD33_3: DD33.3(IN) R130.1 R131.2 X7.18
NetDD42_3: DD42.3(Y) R129.2
NetDD42_6: DD42.6(Y) R196.2
NetDD42_8: DD42.8(Y) R9.2
NetDD42_11: DD42.11(Y) R11.2
NetR9_1: R9.1 X31.16
NetR11_1: R11.1 X7.13
NetR13_1: R13.1 X7.15
NetR19_1: R19.1 X7.16
NetR129_1: R129.1 X31.13
NetR196_1: R196.1 X31.15

### Notes on the sheet
- Project/Equipment
- Document
- Designer
- Drawn by
- Check.by
- Copyright WUT ISE 2024.
  This documentation describes Open Hardware and is licensed under the CERN OHL v.2. You may redistribute and modify this documentation under the terms of the CERN OHL v.2. (http://ohwr.org/CERNOHL). This documentation is distributed WITHOUT ANY EXPRESS OR IMPLIED WARRANTY, INCLUDING OF MERCHANTABILITY, SATISFACTORY QUALITY AND FITNESS FOR A PARTICULAR PURPOSE. Please see the CERN OHL v.2 for applicable conditions.
- Contact
- File
- Last Mod.
- Print Date
- Sheet
- Size
- A3
- of
- Rev

### Library data of the parts
C21 = CC0805_220NF_50V_10%_X7R: as C227 on sheet FIT_HDMI_X19-9; Part Number: CC0805_220NF_50V_10%_X7R; Component Kind: Standard; Component Type: Standard; Pin Count: 2; Value: 220nF; Status: Preferred; Manufacturer Part Number: CC0805_220NF_50V_10%_X7R; Case: 0805; Mounted: Yes; Socket: No; SMD: Yes; Sense: No; Manufacturer1 Example: MURATA; Manufacturer1 ComponentHeight: 1.35mm; HelpURL: \\cern.ch\dfs\Applications\Altium\Datasheets\CC0805_X7R_MURATA.pdf; Author: CERN DEM JLC; CreateDate: 03.12.2007; LatestRevisionDate: 03.12.2007
DD2 DD42 = SN74LVC08AD: as DD24 on sheet FIT_HDMI_X19-9; Part Number: SN74LVC08AD; Component Kind: Standard; Component Type: Standard; Device: SN74LVC08AD; PackageDescription: SOIC 14, Pitch 1.27mm - Body 4x8.75mm, IPC Medium Density; Manufacturer Part Number: SN74LVC08AD; Pin Count: 14; Case: SOIC14; Mounted: Yes; Socket: No; SMD: Yes; Sense: No; ComponentHeight: 1.75mm; Author: CERN DEM JLC; HelpURL: \\cern.ch\dfs\Applications\Altium\Datasheets\SN74LVC08AD.pdf; CreateDate: 21.03.2012; LatestRevisionDate: 21.03.2012
DD33 = SN74LVC14AD: as DD34 on sheet FIT_HDMI_X19-9; Part Number: SN74LVC14AD; Component Kind: Standard; Component Type: Standard; Device: SN74LVC14AD; PackageDescription: SOIC 14, Pitch 1.27mm - Body 4x8.75mm, IPC Medium Density; Part Description: Hex Schmitt-Trigger Inverter; Manufacturer Part Number: SN74LVC14AD; Pin Count: 14; Case: SOIC14; Mounted: Yes; Socket: No; SMD: Yes; Sense: No; ComponentHeight: 1.75mm; Author: CERN DEM JMW; HelpURL: \\cern.ch\dfs\Applications\Altium\Datasheets\SN74LVC14AD.pdf; CreateDate: 29.09.2008; LatestRevisionDate: 29.09.2008
R9 R11 R13 R19 R129 R196 = R0805_47R_1%_0.125W_100PPM: as R62 on sheet FIT_HDMI_X19-9; Part Number: R0805_47R_1%_0.125W_100PPM; Component Kind: Standard; Component Type: Standard; Pin Count: 2; Value: 47; Status: Preferred; Manufacturer Part Number: R0805_47R_1%_0.125W_100PPM; Case: 0805; Mounted: Yes; Sense: No; Socket: No; SMD: Yes; Manufacturer1 Example: NIC COMPONENT; Manufacturer1 ComponentHeight: 0.6mm; HelpURL: \\cern.ch\dfs\Applications\Altium\Datasheets\R0805_NIC_NRC.pdf; Author: CERN DEM JLC; CreateDate: 03.12.2007; LatestRevisionDate: 13.03.2008
R128 R130 R131 R203 = R0805_200R_1%_0.125W_100PPM: as R163-R166 on sheet FIT_HDMI_X19-9; Part Number: R0805_200R_1%_0.125W_100PPM; Component Kind: Standard; Component Type: Standard; Pin Count: 2; Value: 200; Status: Preferred; Manufacturer Part Number: R0805_200R_1%_0.125W_100PPM; Case: 0805; Mounted: Yes; Sense: No; Socket: No; SMD: Yes; Manufacturer1 Example: NIC COMPONENT; Manufacturer1 ComponentHeight: 0.6mm; HelpURL: \\cern.ch\dfs\Applications\Altium\Datasheets\R0805_NIC_NRC.pdf; Author: CERN DEM JLC; CreateDate: 03.12.2007; LatestRevisionDate: 13.03.2008
X7 X31 = TYCO_2007435-1: as X9 on sheet FIT_HDMI_X19-9; Part Number: TYCO_2007435-1; Component Kind: Standard; Component Type: Standard; Pin Count: 23; Family: HDMI; Mounted: Yes; Socket: No; SMD: No; Sense: No; Status: None; Manufacturer Part Number: 2007435-1; ComponentHeight: 16.4mm; HelpURL: \\cern.ch\dfs\Applications\Altium\Datasheets\TYCO_2007435-1.pdf; Author: CERN DEM MR; CreateDate: 05.07.2016; LatestRevisionDate: 05.07.2016

## Sheet FIT_HDMI_X27-23.SchDoc: FIT_PM12 board
size 420 x 297 mm; CheckedBy: G.Kasprowicz; Author: INR Moscow; CompanyName: WUT ISE; DrawnBy: M.Podgórski; Organization: WUT ISE; Address1: PW ISE; Address2: Nowowiejska 15/19 00-665 Warsaw; Address3: gkasprow@gmail.com; Revision: 2; SheetNumber: -; SheetTotal: -; ModifiedBy: -; CheckedDate: -; Title2: Title 2; DivGrp: WUT ISE; Designer: INR RAS; ModifiedDate: -; ProjectName: Sensor Box
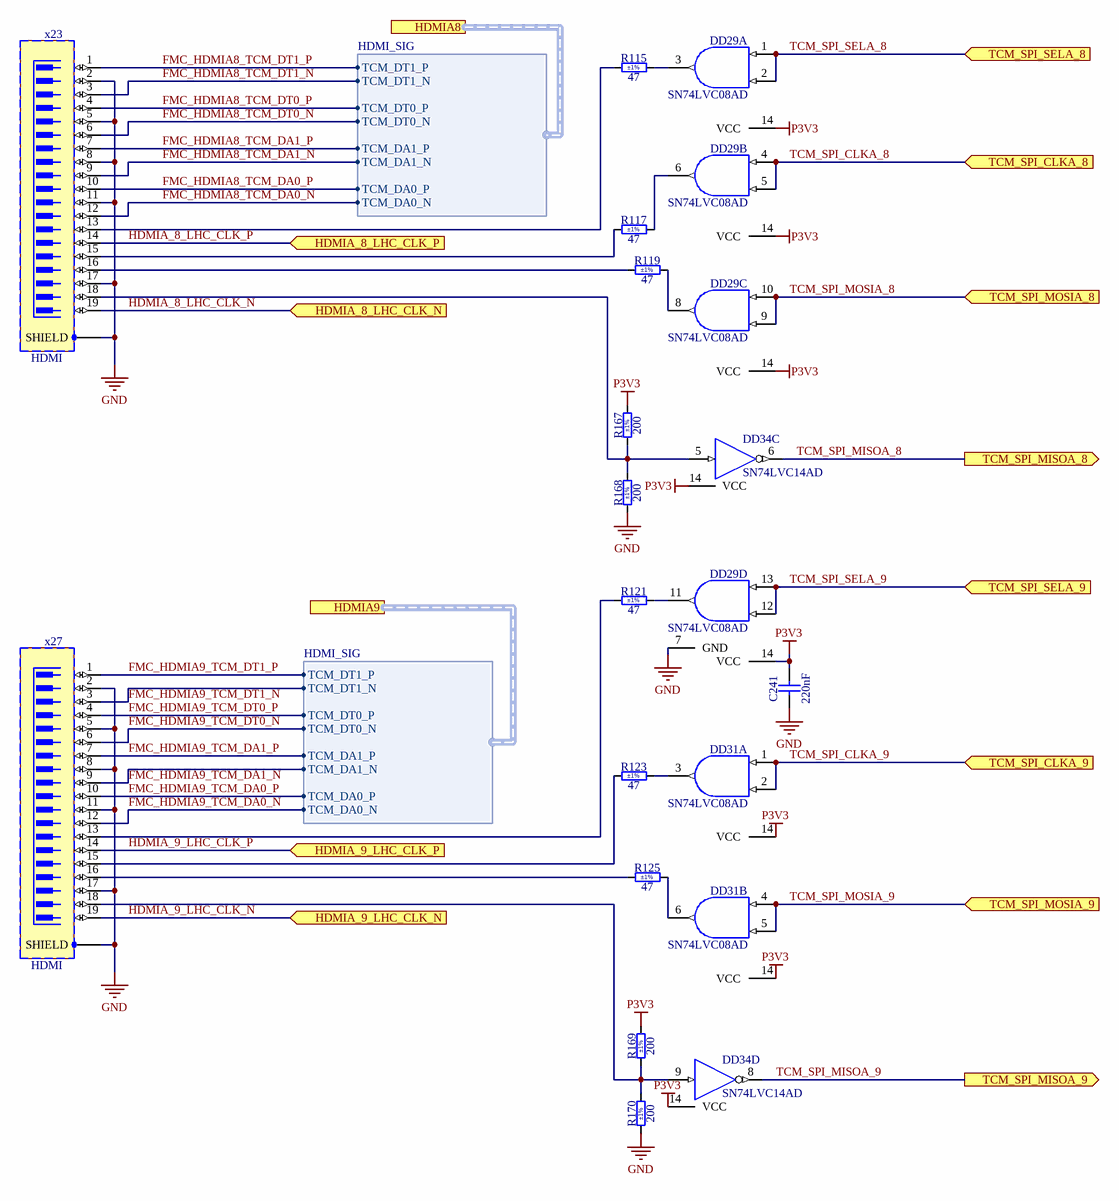
[diagram p26: FIT_HDMI_X27-23.SchDoc]

### Parts
C241  220nF  [CAPC2012X135N]
DD29  SN74LVC08AD  [SOIC127P600X175-14N]  (parts A,B,C,D of 4)
DD31  SN74LVC08AD  [SOIC127P600X175-14N]  (parts A,B of 4)
DD34  SN74LVC14AD  [SOIC127P600X175-14N]  (parts C,D of 6)
R115  47  Tolerance: ±1%  [RESC2012X60N]
R117  47  Tolerance: ±1%  [RESC2012X60N]
R119  47  Tolerance: ±1%  [RESC2012X60N]
R121  47  Tolerance: ±1%  [RESC2012X60N]
R123  47  Tolerance: ±1%  [RESC2012X60N]
R125  47  Tolerance: ±1%  [RESC2012X60N]
R167  200  Tolerance: ±1%  [RESC2012X60N]
R168  200  Tolerance: ±1%  [RESC2012X60N]
R169  200  Tolerance: ±1%  [RESC2012X60N]
R170  200  Tolerance: ±1%  [RESC2012X60N]
x23  HDMI  [TYCO_2007435-1]
x27  HDMI  [TYCO_2007435-1]

### Ports
HDMIA8 (harness HDMI_SIG), HDMIA9 (harness HDMI_SIG), HDMIA_8_LHC_CLK_N (in), HDMIA_8_LHC_CLK_P (in), HDMIA_9_LHC_CLK_N (in), HDMIA_9_LHC_CLK_P (in), TCM_SPI_CLKA_8 (in), TCM_SPI_CLKA_9 (in), TCM_SPI_MISOA_8 (out), TCM_SPI_MISOA_9 (out), TCM_SPI_MOSIA_8 (in), TCM_SPI_MOSIA_9 (in), TCM_SPI_SELA_8 (in), TCM_SPI_SELA_9 (in)

### Harnesses
HDMI_SIG: TCM_DT1_P, TCM_DT1_N, TCM_DT0_P, TCM_DT0_N, TCM_DA1_P, TCM_DA1_N, TCM_DA0_P, TCM_DA0_N

### Nets
GND: C241.1 DD29.7(GND) DD31.7(GND) DD34.7(GND) R168.1 R170.1 x23.2 x23.5 x23.8 x23.11 x23.17 x23.SHIELD x27.2 x27.5 x27.8 x27.11 x27.17 x27.SHIELD
P3V3: C241.2 DD29.14(VCC) DD31.14(VCC) DD34.14(VCC) R167.2 R169.2  [also labelled VCC]
FMC_HDMIA8_TCM_DA0_N: x23.12 ; port HDMIA8.TCM_DA0_N  [project net HDMIA8.TCM_DA0_N]
FMC_HDMIA8_TCM_DA0_P: x23.10 ; port HDMIA8.TCM_DA0_P  [project net HDMIA8.TCM_DA0_P]
FMC_HDMIA8_TCM_DA1_N: x23.9 ; port HDMIA8.TCM_DA1_N  [project net HDMIA8.TCM_DA1_N]
FMC_HDMIA8_TCM_DA1_P: x23.7 ; port HDMIA8.TCM_DA1_P  [project net HDMIA8.TCM_DA1_P]
FMC_HDMIA8_TCM_DT0_N: x23.6 ; port HDMIA8.TCM_DT0_N  [project net HDMIA8.TCM_DT0_N]
FMC_HDMIA8_TCM_DT0_P: x23.4 ; port HDMIA8.TCM_DT0_P  [project net HDMIA8.TCM_DT0_P]
FMC_HDMIA8_TCM_DT1_N: x23.3 ; port HDMIA8.TCM_DT1_N  [project net HDMIA8.TCM_DT1_N]
FMC_HDMIA8_TCM_DT1_P: x23.1 ; port HDMIA8.TCM_DT1_P  [project net HDMIA8.TCM_DT1_P]
FMC_HDMIA9_TCM_DA0_N: x27.12 ; port HDMIA9.TCM_DA0_N  [project net HDMIA9.TCM_DA0_N]
FMC_HDMIA9_TCM_DA0_P: x27.10 ; port HDMIA9.TCM_DA0_P  [project net HDMIA9.TCM_DA0_P]
FMC_HDMIA9_TCM_DA1_N: x27.9 ; port HDMIA9.TCM_DA1_N  [project net HDMIA9.TCM_DA1_N]
FMC_HDMIA9_TCM_DA1_P: x27.7 ; port HDMIA9.TCM_DA1_P  [project net HDMIA9.TCM_DA1_P]
FMC_HDMIA9_TCM_DT0_N: x27.6 ; port HDMIA9.TCM_DT0_N  [project net HDMIA9.TCM_DT0_N]
FMC_HDMIA9_TCM_DT0_P: x27.4 ; port HDMIA9.TCM_DT0_P  [project net HDMIA9.TCM_DT0_P]
FMC_HDMIA9_TCM_DT1_N: x27.3 ; port HDMIA9.TCM_DT1_N  [project net HDMIA9.TCM_DT1_N]
FMC_HDMIA9_TCM_DT1_P: x27.1 ; port HDMIA9.TCM_DT1_P  [project net HDMIA9.TCM_DT1_P]
HDMIA_8_LHC_CLK_N: x23.19 ; port HDMIA_8_LHC_CLK_N  [project net HDMIA_LHC.8_LHC_CLK_N]
HDMIA_8_LHC_CLK_P: x23.14 ; port HDMIA_8_LHC_CLK_P  [project net HDMIA_LHC.8_LHC_CLK_P]
HDMIA_9_LHC_CLK_N: x27.19 ; port HDMIA_9_LHC_CLK_N  [project net HDMIA_LHC.9_LHC_CLK_N]
HDMIA_9_LHC_CLK_P: x27.14 ; port HDMIA_9_LHC_CLK_P  [project net HDMIA_LHC.9_LHC_CLK_P]
TCM_SPI_CLKA_8: DD29.4(A) DD29.5(B) ; port TCM_SPI_CLKA_8
TCM_SPI_CLKA_9: DD31.1(A) DD31.2(B) ; port TCM_SPI_CLKA_9
TCM_SPI_MISOA_8: DD34.6(OUT) ; port TCM_SPI_MISOA_8
TCM_SPI_MISOA_9: DD34.8(OUT) ; port TCM_SPI_MISOA_9
TCM_SPI_MOSIA_8: DD29.9(B) DD29.10(A) ; port TCM_SPI_MOSIA_8
TCM_SPI_MOSIA_9: DD31.4(A) DD31.5(B) ; port TCM_SPI_MOSIA_9
TCM_SPI_SELA_8: DD29.1(A) DD29.2(B) ; port TCM_SPI_SELA_8
TCM_SPI_SELA_9: DD29.12(B) DD29.13(A) ; port TCM_SPI_SELA_9
NetDD29_3: DD29.3(Y) R115.2
NetDD29_6: DD29.6(Y) R117.2
NetDD29_8: DD29.8(Y) R119.2
NetDD29_11: DD29.11(Y) R121.2
NetDD31_3: DD31.3(Y) R123.2
NetDD31_6: DD31.6(Y) R125.2
NetDD34_5: DD34.5(IN) R167.1 R168.2 x23.18
NetDD34_9: DD34.9(IN) R169.1 R170.2 x27.18
NetR115_1: R115.1 x23.13
NetR117_1: R117.1 x23.15
NetR119_1: R119.1 x23.16
NetR121_1: R121.1 x27.13
NetR123_1: R123.1 x27.15
NetR125_1: R125.1 x27.16

### Notes on the sheet
- Project/Equipment
- Document
- Designer
- Drawn by
- Check.by
- Copyright WUT ISE 2024.
  This documentation describes Open Hardware and is licensed under the CERN OHL v.2. You may redistribute and modify this documentation under the terms of the CERN OHL v.2. (http://ohwr.org/CERNOHL). This documentation is distributed WITHOUT ANY EXPRESS OR IMPLIED WARRANTY, INCLUDING OF MERCHANTABILITY, SATISFACTORY QUALITY AND FITNESS FOR A PARTICULAR PURPOSE. Please see the CERN OHL v.2 for applicable conditions.
- Contact
- File
- Last Mod.
- Print Date
- Sheet
- Size
- A3
- of
- Rev

### Library data of the parts
C241 = CC0805_220NF_50V_10%_X7R: as C227 on sheet FIT_HDMI_X19-9; Part Number: CC0805_220NF_50V_10%_X7R; Component Kind: Standard; Component Type: Standard; Pin Count: 2; Value: 220nF; Status: Preferred; Manufacturer Part Number: CC0805_220NF_50V_10%_X7R; Case: 0805; Mounted: Yes; Socket: No; SMD: Yes; Sense: No; Manufacturer1 Example: MURATA; Manufacturer1 ComponentHeight: 1.35mm; HelpURL: \\cern.ch\dfs\Applications\Altium\Datasheets\CC0805_X7R_MURATA.pdf; Author: CERN DEM JLC; CreateDate: 03.12.2007; LatestRevisionDate: 03.12.2007
DD29 DD31 = SN74LVC08AD: as DD24 on sheet FIT_HDMI_X19-9; Part Number: SN74LVC08AD; Component Kind: Standard; Component Type: Standard; Device: SN74LVC08AD; PackageDescription: SOIC 14, Pitch 1.27mm - Body 4x8.75mm, IPC Medium Density; Manufacturer Part Number: SN74LVC08AD; Pin Count: 14; Case: SOIC14; Mounted: Yes; Socket: No; SMD: Yes; Sense: No; ComponentHeight: 1.75mm; Author: CERN DEM JLC; HelpURL: \\cern.ch\dfs\Applications\Altium\Datasheets\SN74LVC08AD.pdf; CreateDate: 21.03.2012; LatestRevisionDate: 21.03.2012
DD34 = SN74LVC14AD: as DD34 on sheet FIT_HDMI_X19-9; Part Number: SN74LVC14AD; Component Kind: Standard; Component Type: Standard; Device: SN74LVC14AD; PackageDescription: SOIC 14, Pitch 1.27mm - Body 4x8.75mm, IPC Medium Density; Part Description: Hex Schmitt-Trigger Inverter; Manufacturer Part Number: SN74LVC14AD; Pin Count: 14; Case: SOIC14; Mounted: Yes; Socket: No; SMD: Yes; Sense: No; ComponentHeight: 1.75mm; Author: CERN DEM JMW; HelpURL: \\cern.ch\dfs\Applications\Altium\Datasheets\SN74LVC14AD.pdf; CreateDate: 29.09.2008; LatestRevisionDate: 29.09.2008
R115 R117 R119 R121 R123 R125 = R0805_47R_1%_0.125W_100PPM: as R62 on sheet FIT_HDMI_X19-9; Part Number: R0805_47R_1%_0.125W_100PPM; Component Kind: Standard; Component Type: Standard; Pin Count: 2; Value: 47; Status: Preferred; Manufacturer Part Number: R0805_47R_1%_0.125W_100PPM; Case: 0805; Mounted: Yes; Sense: No; Socket: No; SMD: Yes; Manufacturer1 Example: NIC COMPONENT; Manufacturer1 ComponentHeight: 0.6mm; HelpURL: \\cern.ch\dfs\Applications\Altium\Datasheets\R0805_NIC_NRC.pdf; Author: CERN DEM JLC; CreateDate: 03.12.2007; LatestRevisionDate: 13.03.2008
R167-R170 = R0805_200R_1%_0.125W_100PPM: as R163-R166 on sheet FIT_HDMI_X19-9; Part Number: R0805_200R_1%_0.125W_100PPM; Component Kind: Standard; Component Type: Standard; Pin Count: 2; Value: 200; Status: Preferred; Manufacturer Part Number: R0805_200R_1%_0.125W_100PPM; Case: 0805; Mounted: Yes; Sense: No; Socket: No; SMD: Yes; Manufacturer1 Example: NIC COMPONENT; Manufacturer1 ComponentHeight: 0.6mm; HelpURL: \\cern.ch\dfs\Applications\Altium\Datasheets\R0805_NIC_NRC.pdf; Author: CERN DEM JLC; CreateDate: 03.12.2007; LatestRevisionDate: 13.03.2008
x23 x27 = TYCO_2007435-1: as X9 on sheet FIT_HDMI_X19-9; Part Number: TYCO_2007435-1; Component Kind: Standard; Component Type: Standard; Pin Count: 23; Family: HDMI; Mounted: Yes; Socket: No; SMD: No; Sense: No; Status: None; Manufacturer Part Number: 2007435-1; ComponentHeight: 16.4mm; HelpURL: \\cern.ch\dfs\Applications\Altium\Datasheets\TYCO_2007435-1.pdf; Author: CERN DEM MR; CreateDate: 05.07.2016; LatestRevisionDate: 05.07.2016